# Altium schematic sheet servo.SchDoc
size A
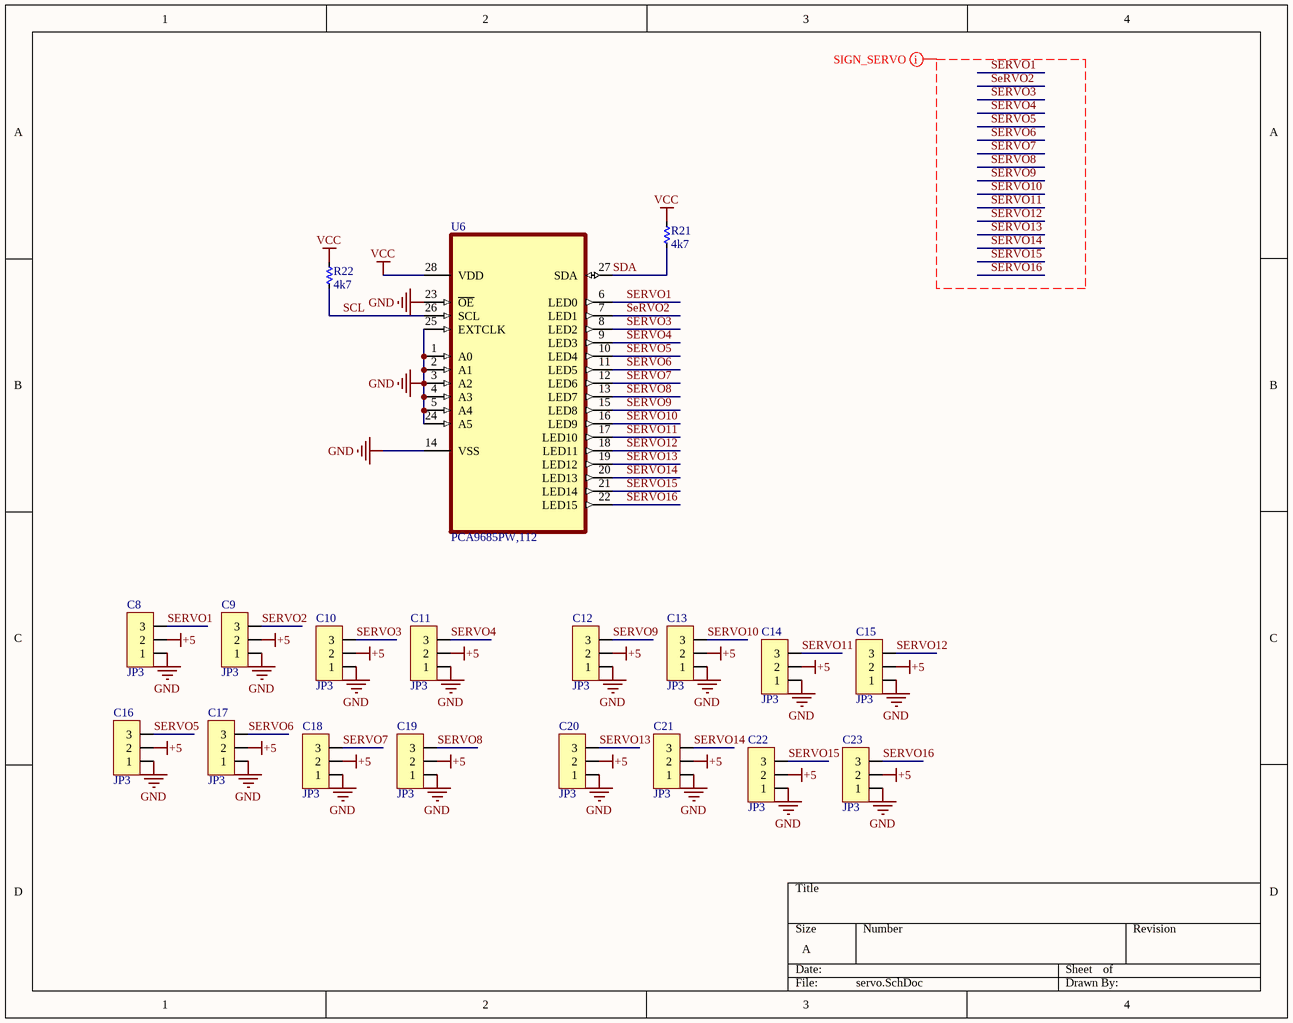
[diagram p0: servo.SchDoc]

## Parts
C8  JP3  [JP3-D1T]
C9  JP3  [JP3-D1T]
C10  JP3  [JP3-D1T]
C11  JP3  [JP3-D1T]
C12  JP3  [JP3-D1T]
C13  JP3  [JP3-D1T]
C14  JP3  [JP3-D1T]
C15  JP3  [JP3-D1T]
C16  JP3  [JP3-D1T]
C17  JP3  [JP3-D1T]
C18  JP3  [JP3-D1T]
C19  JP3  [JP3-D1T]
C20  JP3  [JP3-D1T]
C21  JP3  [JP3-D1T]
C22  JP3  [JP3-D1T]
C23  JP3  [JP3-D1T]
R21  4k7  [RES-SMD-0603]
R22  4k7  [RES-SMD-0603]
U6  PCA9685PW,112  [SOP65P640X110-28N]

## Nets
+5: C8.2 C9.2 C10.2 C11.2 C12.2 C13.2 C14.2 C15.2 C16.2 C17.2 C18.2 C19.2 C20.2 C21.2 C22.2 C23.2
GND: C8.1 C9.1 C10.1 C11.1 C12.1 C13.1 C14.1 C15.1 C16.1 C17.1 C18.1 C19.1 C20.1 C21.1 C22.1 C23.1 U6.1(A0) U6.2(A1) U6.3(A2) U6.4(A3) U6.5(A4) U6.14(VSS) U6.23(~{OE}) U6.24(A5) U6.25(EXTCLK)
VCC: R21.2 R22.2 U6.28(VDD)
SCL: R22.1 U6.26(SCL)
SDA: R21.1 U6.27(SDA)
SERVO1: C8.3 U6.6(LED0)
SeRVO2: C9.3 U6.7(LED1)
SERVO3: C10.3 U6.8(LED2)
SERVO4: C11.3 U6.9(LED3)
SERVO5: C16.3 U6.10(LED4)
SERVO6: C17.3 U6.11(LED5)
SERVO7: C18.3 U6.12(LED6)
SERVO8: C19.3 U6.13(LED7)
SERVO9: C12.3 U6.15(LED8)
SERVO10: C13.3 U6.16(LED9)
SERVO11: C14.3 U6.17(LED10)
SERVO12: C15.3 U6.18(LED11)
SERVO13: C20.3 U6.19(LED12)
SERVO14: C21.3 U6.20(LED13)
SERVO15: C22.3 U6.21(LED14)
SERVO16: C23.3 U6.22(LED15)

## Layout directives
net class SIGN_SERVO: SERVO1, SeRVO2, SERVO3, SERVO4, SERVO5, SERVO6, SERVO7, SERVO8, SERVO9, SERVO10, SERVO11, SERVO12, SERVO13, SERVO14, SERVO15, SERVO16

## Library data of the parts
C8-C23 = JP3: WR-PHD 2.54 mm Angled Socket Header; Manufacturer: W¨¹rth Elektronik eiSos GmbH; partNo: 613003143121; ComponentLink1 Description: Manufacturer; ComponentLink2 Description: Datasheet; NoPins: 03; Created Date: 29 March 2013; ComponentLink1URL: http://www.we-online.com; ComponentLink2URL: http://katalog.we-online.de/em/datasheet/6130xx143121.pdf; Created by: Karrer Zheng
R21 R22 = Res-SMD: Resistor; Manufacturer: Generic Components; Class: Passive; Published: 08/06/2000; Publisher: Altium Hobart Technology Centre
U6 = PCA9685PW,112: LED Driver IC 16 Output Linear PWM Dimming 25mA 28-TSSOP; MF: NXP USA; Purchase-URL: https://pricing.snapeda.com/search/part/PCA9685PW,112/?ref=eda; Value: *; Package: TSSOP-28 NXP Semiconductors; Digi-Key_Part_Number: 568-8366-5-ND; SnapEDA_Link: https://www.snapeda.com/parts/PCA9685PW,112/NXP%20USA%20Inc./view-part/550390/?ref=snap; MP: PCA9685PW,112; Check_prices: https://www.snapeda.com/parts/PCA9685PW,112/NXP%20USA%20Inc./view-part/550390/?ref=eda